# Altium project Z80Board.PrjPCB
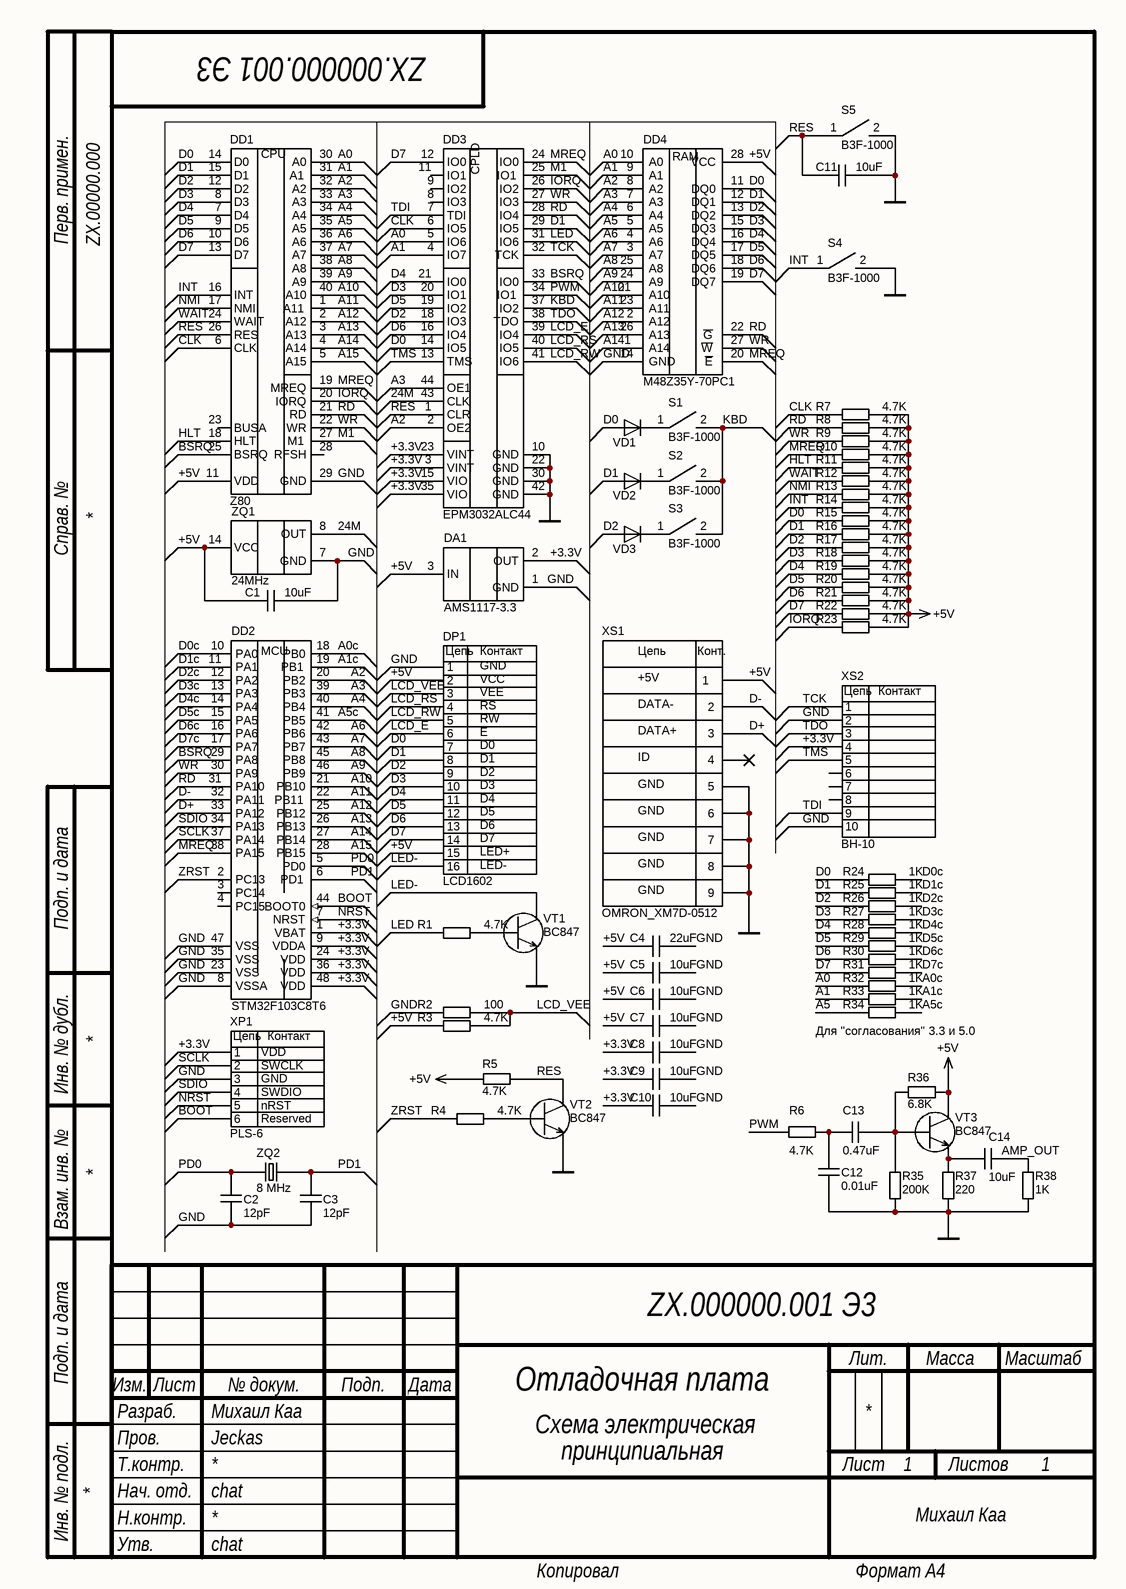
[diagram p0: main.SchDoc]
1 sheet, 74 parts. Net scope: global (net labels, ports and power ports of the same name join across sheets).
Board file: pcb.PcbDoc

## Sheet main.SchDoc
size 209 x 297 mm; Address1: Address1; Address2: Address2; Address3: Address3; Address4: Address4; SheetNumber: 1; SheetTotal: 1; Scale: 1:1; Разраб.: Михаил Каа; Обозначение документа: ZX.000000.001 Э3; Пров.: Jeckas; Утв.: chat; Номер листа: 1; Общее количество листов: 1; Наименование организации: Михаил Каа; Перв. применение: ZX.00000.000; Наименование изделия 1: Отладочная плата; Наименование изделия 2: Схема электрическая; Наименование изделия 3: принципиальная; Нач. отд.: Нач. отд.; Фамилия нач. отд.: chat

### Parts
C1  10uF  [C0805]
C2  12pF  [C0805]
C3  12pF  [C0805]
C4  22uF  [С1206]
C5  10uF  [C0805]
C6  10uF  [C0805]
C7  10uF  [C0805]
C8  10uF  [C0805]
C9  10uF  [C0805]
C10  10uF  [C0805]
C11  10uF  [C0805]
C12  0.01uF  [C0805]
C13  0.47uF  [C0805]
C14  10uF  [C0805]
DA1  AMS1117-3.3  [SOT229P700X180-4N]
DD1  Z80  [DIP1540W47P254L5320H635Q40B]
DD2  STM32F103C8T6  [QFP50P900X900X160-48N]
DD3  EPM3032ALC44  [PLCC-44-R]
DD4  M48Z35Y-70PC1  [DIP254P1524X965-28]
DP1  LCD1602  [LCD1602]
R1  4.7K  [R0805]
R2  100  [R0805]
R3  4.7K  [R0805]
R4  4.7K  [R0805]
R5  4.7K  [R0805]
R6  4.7K  [R0805]
R7  4.7K  [R0805]
R8  4.7K  [R0805]
R9  4.7K  [R0805]
R10  4.7K  [R0805]
R11  4.7K  [R0805]
R12  4.7K  [R0805]
R13  4.7K  [R0805]
R14  4.7K  [R0805]
R15  4.7K  [R0805]
R16  4.7K  [R0805]
R17  4.7K  [R0805]
R18  4.7K  [R0805]
R19  4.7K  [R0805]
R20  4.7K  [R0805]
R21  4.7K  [R0805]
R22  4.7K  [R0805]
R23  4.7K  [R0805]
R24  1K  [R0805]
R25  1K  [R0805]
R26  1K  [R0805]
R27  1K  [R0805]
R28  1K  [R0805]
R29  1K  [R0805]
R30  1K  [R0805]
R31  1K  [R0805]
R32  1K  [R0805]
R33  1K  [R0805]
R34  1K  [R0805]
R35  200K  [R0805]
R36  6.8K  [R0805]
R37  220  [R0805]
R38  1K  [R0805]
S1  B3F-1000  [SW_B3F-1000]
S2  B3F-1000  [SW_B3F-1000]
S3  B3F-1000  [SW_B3F-1000]
S4  B3F-1000  [SW_B3F-1000]
S5  B3F-1000  [SW_B3F-1000]
VD1  1N4148W  [SODFL1608X70N]  (value not drawn)
VD2  1N4148W  [SODFL1608X70N]  (value not drawn)
VD3  1N4148W  [SODFL1608X70N]  (value not drawn)
VT1  BC847  [BC847]
VT2  BC847  [BC847]
VT3  BC847  [BC847]
XP1  PLS-6  [6pin]
XS1  OMRON_XM7D-0512  [OMRON_XM7D-0512]
XS2  BH-10  [BH-10]
ZQ1  24MHz  [OSC_ECS-100A-240]
ZQ2  8 MHz  [XTAL_ECS-80-S-4]

### Nets
+5V: C1.1 C4.1 C5.1 C6.1 C7.1 DA1.3(IN) DD1.11(VDD) DD4.28(VCC) DP1.2 DP1.15 R3.1 R5.2 R7.2 R8.2 R9.2 R10.2 R11.2 R12.2 R13.2 R14.2 R15.2 R16.2 R17.2 R18.2 R19.2 R20.2 R21.2 R22.2 R23.2 R36.1 VT3.3(C) XS1.1 ZQ1.14(VCC)
GND: C1.2 C2.1 C3.1 C4.2 C5.2 C6.2 C7.2 C8.2 C9.2 C10.2 C11.2 C12.1 DA1.1(GND) DD1.29(GND) DD2.8(VSSA) DD2.23(VSS) DD2.35(VSS) DD2.47(VSS) DD3.10(GND) DD3.22(GND) DD3.30(GND) DD3.42(GND) DD4.14(GND) DP1.1 R2.1 R35.1 R37.2 R38.2 S4.2 S5.2 VT1.2(E) VT2.2(E) XP1.3 XS1.5 XS1.6 XS1.7 XS1.8 XS1.9 XS2.2 XS2.10 ZQ1.7(GND)
24M: DD3.43(CLK) ZQ1.8(OUT)
+3.3V: C8.1 C9.1 C10.1 DA1.2(OUT) DD2.1(VBAT) DD2.9(VDDA) DD2.24(VDD) DD2.36(VDD) DD2.48(VDD) DD3.3(VINT) DD3.15(VIO) DD3.23(VINT) DD3.35(VIO) XP1.1 XS2.4
A0: DD1.30(A0) DD3.5(IO6) DD4.10(A0) R32.1
A0c: DD2.18(PB0) R32.2
A1: DD1.31(A1) DD3.4(IO7) DD4.9(A1) R33.1
A1c: DD2.19(PB1) R33.2
A2: DD1.32(A2) DD2.20(PB2) DD3.2(OE2) DD4.8(A2)
A3: DD1.33(A3) DD2.39(PB3) DD3.44(OE1) DD4.7(A3)
A4: DD1.34(A4) DD2.40(PB4) DD4.6(A4)
A5: DD1.35(A5) DD4.5(A5) R34.1
A5c: DD2.41(PB5) R34.2
A6: DD1.36(A6) DD2.42(PB6) DD4.4(A6)
A7: DD1.37(A7) DD2.43(PB7) DD4.3(A7)
A8: DD1.38(A8) DD2.45(PB8) DD4.25(A8)
A9: DD1.39(A9) DD2.46(PB9) DD4.24(A9)
A10: DD1.40(A10) DD2.21(PB10) DD4.21(A10)
A11: DD1.1(A11) DD2.22(PB11) DD4.23(A11)
A12: DD1.2(A12) DD2.25(PB12) DD4.2(A12)
A13: DD1.3(A13) DD2.26(PB13) DD4.26(A13)
A14: DD1.4(A14) DD2.27(PB14) DD4.1(A14)
A15: DD1.5(A15) DD2.28(PB15)
AMP_OUT: C14.2 R38.1
BOOT: DD2.44(BOOT0) XP1.6
BSRQ: DD1.25(BSRQ) DD2.29(PA8) DD3.33(IO0)
CLK: DD1.6(CLK) DD3.6(IO5) R7.1
D0: DD1.14(D0) DD3.14(IO5) DD4.11(DQ0) DP1.7 R15.1 R24.1 VD1.A
D0c: DD2.10(PA0) R24.2
D1: DD1.15(D1) DD3.29(IO5) DD4.12(DQ1) DP1.8 R16.1 R25.1 VD2.A
D1c: DD2.11(PA1) R25.2
D2: DD1.12(D2) DD3.18(IO3) DD4.13(DQ2) DP1.9 R17.1 R26.1 VD3.A
D2c: DD2.12(PA2) R26.2
D3: DD1.8(D3) DD3.20(IO1) DD4.15(DQ3) DP1.10 R18.1 R27.1
D3c: DD2.13(PA3) R27.2
D4: DD1.7(D4) DD3.21(IO0) DD4.16(DQ4) DP1.11 R19.1 R28.1
D4c: DD2.14(PA4) R28.2
D5: DD1.9(D5) DD3.19(IO2) DD4.17(DQ5) DP1.12 R20.1 R29.1
D5c: DD2.15(PA5) R29.2
D6: DD1.10(D6) DD3.16(IO4) DD4.18(DQ6) DP1.13 R21.1 R30.1
D6c: DD2.16(PA6) R30.2
D7: DD1.13(D7) DD3.12(IO0) DD4.19(DQ7) DP1.14 R22.1 R31.1
D7c: DD2.17(PA7) R31.2
D+: DD2.33(PA12) XS1.3
D-: DD2.32(PA11) XS1.2
HLT: DD1.18(HLT) R11.1
INT: DD1.16(INT) R14.1 S4.1
IORQ: DD1.20(IORQ) DD3.26(IO2) R23.1
KBD: DD3.37(IO2) S1.2 S2.2 S3.2
LCD_E: DD3.39(IO4) DP1.6
LCD_RS: DD3.40(IO5) DP1.4
LCD_RW: DD3.41(IO6) DP1.5
LCD_VEE: DP1.3 R2.2 R3.2
LED: DD3.31(IO6) R1.1
LED-: DP1.16 VT1.3(C)
M1: DD1.27(M1) DD3.25(IO1)
MREQ: DD1.19(MREQ) DD2.38(PA15) DD3.24(IO0) DD4.20(~{E}) R10.1
NMI: DD1.17(NMI) R13.1
NRST: DD2.7(NRST) XP1.5
PD0: C2.2 DD2.5(PD0) ZQ2.2
PD1: C3.2 DD2.6(PD1) ZQ2.1
PWM: DD3.34(IO1) R6.1
RD: DD1.21(RD) DD2.31(PA10) DD3.28(IO4) DD4.22(~{G}) R8.1
RES: C11.1 DD1.26(RES) DD3.1(CLR) R5.1 S5.1 VT2.3(C)
SCLK: DD2.37(PA14) XP1.2
SDIO: DD2.34(PA13) XP1.4
TCK: DD3.32(TCK) XS2.1
TDI: DD3.7(TDI) XS2.9
TDO: DD3.38(TDO) XS2.3
TMS: DD3.13(TMS) XS2.5
WAIT: DD1.24(WAIT) R12.1
WR: DD1.22(WR) DD2.30(PA9) DD3.27(IO3) DD4.27(~{W}) R9.1
ZRST: DD2.2(PC13) R4.1
NetC12_2: C12.2 C13.1 R6.2
NetC13_2: C13.2 R35.2 R36.2 VT3.1(B)
NetC14_1: C14.1 R37.1 VT3.2(E)
NetR1_2: R1.2 VT1.1(B)
NetR4_2: R4.2 VT2.1(B)
NetS1_1: S1.1 VD1.C
NetS2_1: S2.1 VD2.C
NetS3_1: S3.1 VD3.C

Not connected (* = marked no-connect by the designer): DD1 23(BUSA) 28(RFSH); DD2 3(PC14) 4(PC15); DD3 8(IO3) 9(IO2) 11(IO1); XS1 4*; XS2 6 7 8

### Notes on the sheet
- (near R34) Для "согласования" 3.3 и 5.0
- Перв. примен.
- Справ. №
- Подп. и дата
- Инв. № дубл.
- Взам. инв. №
- Разраб.
- Изм.
- Лист
- № докум.
- Подп.
- Дата
- Лит.
- Масса
- Масштаб
- Пров.
- Т.контр.
- Листов
- Инв. № подл.
- Утв.
- Н.контр.
- Копировал
- Формат А4
- (in symbol BH-10) Цепь; Контакт
- (in symbol EPM3032ALC44) CPLD
- (in symbol LCD1602) Цепь; Контакт; GND; VCC; VEE; RS; RW; E; D0; D1; D2; D3; D4; D5; D6; D7; LED+; LED-
- (in symbol M48Z35Y-70PC1) RAM
- (in symbol OMRON_XM7D-0512) Цепь; Конт.; +5V; DATA-; DATA+; ID; GND
- (in symbol PLS-6) Цепь; Контакт; VDD; SWCLK; GND; SWDIO; nRST; Reserved
- (in symbol STM32F103C8T6) MCU
- (in symbol Z80) CPU

### Library data of the parts
C1-C14 = CapCer
DD2 = STM32F103C8T6: ARMÂ® CortexÂ®-M3 STM32F1 Microcontroller IC 32-Bit 72MHz 64KB (64K x 8) FLASH 48-LQFP (7x7); MF: STMicroelectronics; Package: LQFP-48 STMicroelectronics; Price: None; Check_prices: https://www.snapeda.com/parts/STM32F103C8T6/STMicroelectronics/view-part/?ref=eda; Value: *; SnapEDA_Link: https://www.snapeda.com/parts/STM32F103C8T6/STMicroelectronics/view-part/?ref=snap; MP: STM32F103C8T6; Availability: In Stock; Purchase-URL: https://pricing.snapeda.com/search/part/STM32F103C8T6/?ref=eda
DD3 = EPM3032ALC44: 44-Pin PLCC44
DD4 = M48Z35Y-70PC1: NVSRAM (Non-Volatile SRAM) Memory IC 256Kb (32K x 8) Parallel 70ns 28-PCDIP, CAPHATÂ®; MF: STMicroelectronics; Package: DIP-28 STMicroelectronics; SnapEDA_Link: https://www.snapeda.com/parts/M48Z35Y-70PC1/STMicroelectronics/view-part/44967/?ref=snap; MP: M48Z35Y-70PC1; Availability: Warning; Price: None; Value: *; Purchase-URL: https://pricing.snapeda.com/search/part/M48Z35Y-70PC1/?ref=eda
R1-R38 = Res
S1-S5 = B3F-1000: pin to pad: 1>1+2 2>4+3; ChipDip PN: 8001787102; Platan PN: 2011347247; Value: 10uF X7R 5%
VT1-VT3 = BC847: NPN Transistor
XS1 = OMRON_XM7D-0512: KLS1-229-5FA-B, Гнездо mini USB, Тип B, угловое, 5 контактов, на плату; № 10557K гн miniUSB \B\5P4C\плат\угл\ \KLS1-229-5FA-B; Ед. изм.: шт; Страна производитель: KLS electronic co ltd; Марка и технические характеристики: OMRON_XM7D-0512; Наименование материалов или оборудования: KLS1-229-5FA-B, Гнездо mini USB, Тип B, угловое, 5 контактов, на плату; № 10557K гн miniUSB \B\5P4C\плат\угл\ \KLS1-229-5FA-B; Value: OMRON_XM7D-0512
XS2 = BH-10: 10 Position Total Dual Row 2.54 mm Pitch Straight Male Shrouded Box Header; MF: Sullins Connector; MP: SBH11-PBPC-D05-ST-BK; SnapEDA_Link: https://www.snapeda.com/parts/SBH11-PBPC-D05-ST-BK/Sullins+Connector+Solutions/view-part/?ref=snap; Package: None; Value: *; Check_prices: https://www.snapeda.com/parts/SBH11-PBPC-D05-ST-BK/Sullins+Connector+Solutions/view-part/?ref=eda
ZQ1 = ECS-100A-240: Oscillator  14-DIP, 4 Leads (Full Size, Metal Can); Package: None; Price: None; Value: *; MP: ECS-100A-240; Availability: Unavailable
ZQ2 = HC-49S_8M